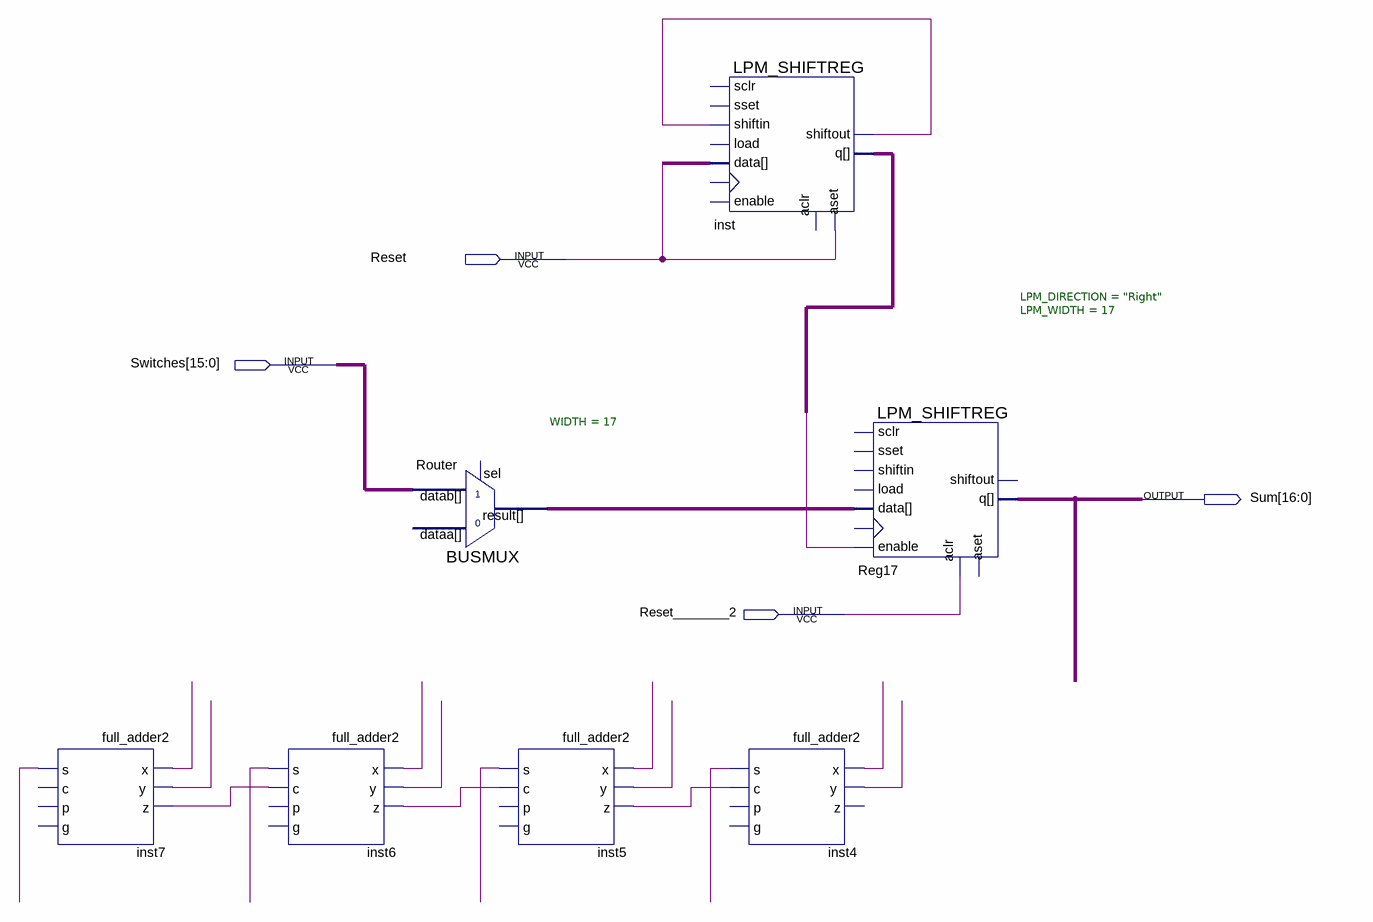
[diagram p0: schematic sheet]
// Quartus schematic Block-rippleadder.bdf as structural Verilog: 7 symbols, 4 pins
module \Block-rippleadder  (
  input  Reset,
  input  [15:0] Switches,
  input  Reset________2,
  output [16:0] Sum
);

  wire inst4_c, inst4_s, inst5_c, inst5_s, inst6_c, inst6_s, inst7_s, inst_q, inst_shiftout, undriven,
       undriven_2, undriven_3, undriven_4, undriven_5, undriven_6, undriven_7, undriven_8, undriven_9;
  wire [16:0] Router_result;

  full_adder2 inst7 (.x(undriven_9), .y(undriven_8), .z(inst6_c), .s(inst7_s));  // open: c, p, g
  full_adder2 inst6 (.x(undriven_7), .y(undriven_6), .z(inst5_c), .s(inst6_s), .c(inst6_c));  // open: p, g
  BUSMUX #(.WIDTH(17)) Router (.datab(Switches), .result(Router_result));  // open: sel, dataa
  full_adder2 inst5 (.x(undriven_3), .y(undriven_2), .z(inst4_c), .s(inst5_s), .c(inst5_c));  // open: p, g
  LPM_SHIFTREG inst (
    .shiftin(inst_shiftout), .data(undriven), .aset(Reset), .shiftout(inst_shiftout), .q(inst_q));  // open: sset, enable, clock, load, sclr, aclr
  full_adder2 inst4 (.x(undriven_5), .y(undriven_4), .s(inst4_s), .c(inst4_c));  // open: z, p, g
  LPM_SHIFTREG #(.LPM_DIRECTION("Right"), .LPM_WIDTH(17)) Reg17 (
    .enable(inst_q), .data(Router_result), .aclr(Reset________2), .q(Sum));  // open: shiftin, sset, clock, load, sclr, aset, shiftout
endmodule
